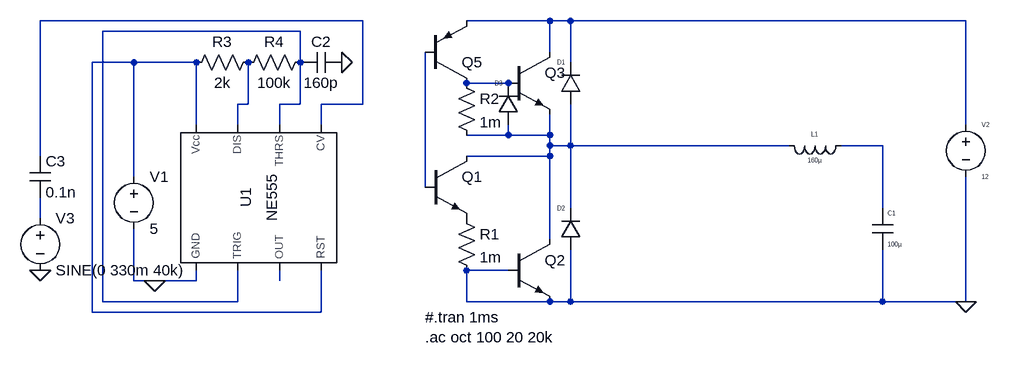
[diagram p0: schematic full_sim.asc]
full_sim.asc, the LTspice schematic file:
Version 4
SHEET 1 1016 776
WIRE 48 192 -448 192
WIRE 336 192 208 192
WIRE 368 192 336 192
WIRE 976 192 368 192
WIRE -48 208 -352 208
WIRE 336 240 336 192
WIRE -304 256 -368 256
WIRE -208 256 -304 256
WIRE -48 256 -48 208
WIRE 368 256 368 192
WIRE 272 288 208 288
WIRE -128 320 -128 256
WIRE -128 320 -144 320
WIRE -48 320 -48 256
WIRE -48 320 -80 320
WIRE 48 320 48 192
WIRE 48 320 -16 320
WIRE -208 352 -208 256
WIRE -144 352 -144 320
WIRE -80 352 -80 320
WIRE -16 352 -16 320
WIRE 976 352 976 192
WIRE 272 368 272 352
WIRE 272 368 208 368
WIRE 336 368 336 336
WIRE 336 368 272 368
WIRE 336 384 336 368
WIRE 368 384 368 320
WIRE 368 384 336 384
WIRE 704 384 368 384
WIRE 848 384 784 384
WIRE -448 400 -448 192
WIRE 336 400 336 384
WIRE 336 400 208 400
WIRE -304 432 -304 256
WIRE 144 448 144 240
WIRE 368 480 368 384
WIRE 848 480 848 384
WIRE -448 496 -448 464
WIRE 336 528 336 400
WIRE 272 576 208 576
WIRE -304 592 -304 512
WIRE -272 592 -304 592
WIRE -208 592 -208 576
WIRE -208 592 -272 592
WIRE -80 592 -80 576
WIRE -352 624 -352 208
WIRE -144 624 -144 576
WIRE -144 624 -352 624
WIRE 208 624 208 576
WIRE 336 624 208 624
WIRE 368 624 368 544
WIRE 368 624 336 624
WIRE 848 624 848 544
WIRE 848 624 368 624
WIRE 976 624 976 432
WIRE 976 624 848 624
WIRE -368 640 -368 256
WIRE -16 640 -16 576
WIRE -16 640 -368 640
FLAG 976 624 0
FLAG -272 592 0
FLAG 16 256 0
FLAG -448 576 0
SYMBOL ind 800 368 R90
WINDOW 0 5 56 VBottom 0
WINDOW 3 32 56 VTop 0
SYMATTR InstName L1
SYMATTR Value 160µ
SYMBOL cap 832 480 R0
WINDOW 0 24 8 Left 0
WINDOW 3 24 56 Left 0
SYMATTR InstName C1
SYMATTR Value 100µ
SYMBOL voltage 976 336 R0
WINDOW 0 24 16 Left 0
WINDOW 3 24 96 Left 0
SYMATTR InstName V2
SYMATTR Value 12
SYMBOL pnp 144 288 M180
WINDOW 3 84 68 Invisible 0
SYMATTR Value 2N2907
SYMATTR InstName Q5
SYMBOL npn 144 400 R0
WINDOW 3 56 68 Invisible 0
SYMATTR Value FZT849
SYMATTR InstName Q1
SYMBOL npn 272 528 R0
WINDOW 3 56 68 Invisible 0
SYMATTR Value FZT849
SYMATTR InstName Q2
SYMBOL npn 272 240 R0
WINDOW 3 56 68 Invisible 0
SYMATTR Value 2N2222
SYMATTR InstName Q3
SYMBOL diode 384 320 R180
WINDOW 0 24 64 Left 0
WINDOW 3 24 0 Invisible 0
SYMATTR InstName D1
SYMBOL diode 384 544 R180
WINDOW 0 24 64 Left 0
WINDOW 3 24 0 Invisible 0
SYMATTR InstName D2
SYMBOL diode 288 352 R180
WINDOW 0 24 64 Left 0
WINDOW 3 24 0 Invisible 0
SYMATTR InstName D3
SYMBOL res 192 480 R0
SYMATTR InstName R1
SYMATTR Value 1m
SYMBOL res 192 272 R0
SYMATTR InstName R2
SYMATTR Value 1m
SYMBOL Misc/NE555 -112 464 R270
SYMATTR InstName U1
SYMBOL voltage -304 416 R0
SYMATTR InstName V1
SYMATTR Value 5
SYMBOL res -112 240 R90
WINDOW 0 0 56 VBottom 2
WINDOW 3 32 56 VTop 2
SYMATTR InstName R3
SYMATTR Value 2k
SYMBOL res -32 240 R90
WINDOW 0 0 56 VBottom 2
WINDOW 3 32 56 VTop 2
SYMATTR InstName R4
SYMATTR Value 100k
SYMBOL cap 16 240 R90
WINDOW 0 0 32 VBottom 2
WINDOW 3 32 32 VTop 2
SYMATTR InstName C2
SYMATTR Value 160p
SYMBOL cap -464 400 R0
SYMATTR InstName C3
SYMATTR Value 0.1n
SYMBOL voltage -448 480 R0
SYMATTR InstName V3
SYMATTR Value SINE(0 330m 40k)
SYMATTR Value2 AC 1
TEXT 144 648 Left 2 !#.tran 1ms\n.ac oct 100 20 20k

The netlist it stands for:
* full_sim.asc
L1 N008 N007 160µ
C1 N008 0 100µ
V2 N002 0 12
Q5 N005 N009 N002 0 2N2907
Q1 N007 N009 P001 0 FZT849
Q2 N007 0 0 0 FZT849
Q3 N002 N005 N007 0 2N2222
D1 N007 N002 D
D2 0 N007 D
D3 N007 N005 D
R1 P001 0 1m
R2 N005 N007 1m
XU1 0 N003 N011 N004 N001 N003 N006 N004 NE555  ; pins GND TRIG OUT RST CV THRS DIS Vcc
V1 N004 0 5
R3 N006 N004 2k
R4 N003 N006 100k
C2 0 N003 160p
C3 N001 N010 0.1n
V3 N010 0 SINE(0 330m 40k) AC 1
.model D D
.lib standard.dio
.model NPN NPN
.model PNP PNP
.lib standard.bjt
#.tran 1ms
.ac oct 100 20 20k
.lib NE555.sub
.backanno
.end